# Altium schematic sheet Connectors.SchDoc: Connectors
size Letter; DrawnBy: Adrianna Ascalon; Organization: UW Robotics; Address1: 200 University Avenue; Address2: Waterloo; Address3: Ontario; Address4: Canada N2L 3G6; SheetNumber: 2; SheetTotal: 3
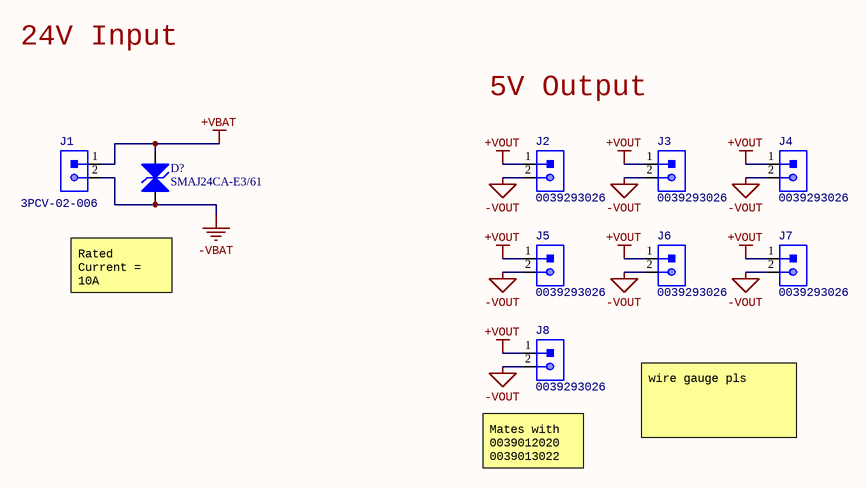
[diagram p0: Connectors.SchDoc]

## Parts
D?  SMAJ24CA-E3/61
J1  3PCV-02-006
J2  0039293026
J3  0039293026
J4  0039293026
J5  0039293026
J6  0039293026
J7  0039293026
J8  0039293026

## Nets
+VBAT: D?.2 J1.1
+VOUT: J2.1 J3.1 J4.1 J5.1 J6.1 J7.1 J8.1
-VBAT: D?.1 J1.2
-VOUT: J2.2 J3.2 J4.2 J5.2 J6.2 J7.2 J8.2

## Notes on the sheet
- 24V Input
- 5V Output
- Rated Current = 10A
- (near J8) Mates with 0039012020 0039013022
- wire gauge pls
- Title
- Size:
- Date:
- Letter
- Drawn By:
- Sheet
- of
- File:

## Library data of the parts
D? = SMAJ24CA-E3/61: TVS DIODE, 400W, 24V, DO-214AC; Manufacturer 1: Vishay Semiconductors; Polarity: Bidirectional; Min Breakdown Voltage: 26.7V; Clamping Voltage: 38.9V; Peak Pulse Current: 10.3A; Test Current: 1mA; Number of Elements: 1; Leakage Current: 1uA; Element Configuration: Single; Max Forward Surge Current (Ifsm): 40A; Power Line Protection: No; Max Breakdown Voltage: 29.5V; Supplier 1: Digi-Key; Stock 1: 6243; Pricing 1: 1=0.35000, 10=0.28400, 25=0.26000, 100=0.16340, 250=0.16152, 500=0.15126 (USD); RoHS: Yes; Case/Package: SMA; Number of Pins: 2; Weight: 0.064g; Contact Plating: Tin,Matte; Min Operating Temperature: -55°C; Max Operating Temperature: 150°C; Packaging: Tape and Reel; Reverse Standoff Voltage: 24V; Peak Pulse Power: 400W; Breakdown Voltage: 26.7V; Package Quantity: 1800; Max Surge Current: 10.3A; Direction: Bidirectional; Reverse Breakdown Voltage: 26.7V; Operating Supply Voltage: 24V; Max Reverse Leakage Current: 1uA; Number of Channels: 1; Max Power Dissipation: 400W; Number of Bidirectional Channels: 1; Composition: Zener; Termination: SMD/SMT; Power Dissipation: 400W; Voltage Rating (DC): 24V; Length: 0.177inch; Height: 0.09inch; Width: 0.11inch; Radiation Hardening: No; Lead Free: Lead Free; REACH SVHC: Unknown; ComponentLink1URL: https://datasheet.ciiva.com/15143/getdatasheetpartid-35124-15143026.pdf?src-supplier=Verical; ComponentLink1Description: https://datasheet.ciiva.com/15143/getdatasheetpartid-35124-15143026.pdf?src-supplier=Verical; ComponentLink2URL: https://datasheet.ciiva.com/4247/2smaj50a-4247844.pdf?src-supplier=Arrow; ComponentLink2Description: https://datasheet.ciiva.com/4247/2smaj50a-4247844.pdf?src-supplier=Arrow; ComponentLink3URL: https://datasheet.ciiva.com/4509/smaj50a-241759-4509561.pdf?src-supplier=Mouser; ComponentLink3Description: https://datasheet.ciiva.com/4509/smaj50a-241759-4509561.pdf?src-supplier=Mouser; ComponentLink4URL: https://datasheet.ciiva.com/22637/548547-22637055.pdf?src-supplier=Element14; ComponentLink4Description: https://datasheet.ciiva.com/22637/548547-22637055.pdf?src-supplier=Element14; Supplier Part Number 1: SMAJ24CA-E3/61GICT-ND; Manufacturer Part Number 1: SMAJ24CA-E3/61
J1 = 3PCV-02-006: Barrier Terminal Blocks TRI-BARRIER .250 2P; Manufacturer 1: TE Connectivity; Number of Contacts: 2; Voltage Rating: 300V; Current Rating: 10A; Mounting Ears: No (Without); Number of Levels: 1; Pitch: 6.35mm; Wire Gauge (Max): 16AWG; Wire Gauge (Min): 30AWG; Thread Size: M3; Supplier 1: Digi-Key; Stock 1: 3086; Pricing 1: 1=1.78000, 10=1.25100, 25=1.16720, 50=1.05920, 100=1.05460, 250=0.89052, 500=0.84364, 1000=0.74990, 5000=0.60930 (USD); RoHS: Yes; Mount: Through Hole; Housing Color: Black; Color: Black; Contact Plating: Tin; Contact Material: Copper Alloy; Terminal Material: Copper Alloy; Housing Material: Thermoplastic; Termination: Solder; Orientation: Straight; Package Quantity: 1000; Number of Rows: 1; Number of Circuits: 2; Number of Positions: 2; Mounting Insert: No (Without); Max Current Rating: 10A; Voltage: 300V; Length: 0.55inch; Height: 0.5inch; Width: 0.55inch; Radiation Hardening: No; Flammability Rating: UL94 V-0; ELV: Compliant; ComponentLink1URL: https://datasheet.ciiva.com/30058/eng-cs-1308389-barrier-strips-0607-30058410.pdf?src-supplier=Onlinecomponents.com; ComponentLink1Description: https://datasheet.ciiva.com/30058/eng-cs-1308389-barrier-strips-0607-30058410.pdf?src-supplier=Onlinecomponents.com; ComponentLink2URL: https://datasheet.ciiva.com/9377/eng-ds-1-1773458-2-barrier-strips-qrg-0810-9377275.pdf?src-supplier=Avnet; ComponentLink2Description: https://datasheet.ciiva.com/9377/eng-ds-1-1773458-2-barrier-strips-qrg-0810-9377275.pdf?src-supplier=Avnet; Manufacturer Part Number 1: 3PCV-02-006
J2-J8 = 0039293026: Conn Wire to Board HDR 2 POS Solder ST Thru-Hole Mini-Fit Jr™ Bag; Manufacturer 1: Molex; Number of Contacts: 2; Gender: Male; Contact Resistance: 10mR; Connector Type: Male Pin; Pitch: 4.2mm; Row Spacing: 0.165inch; Supplier 1: Digi-Key; Stock 1: 23064; Pricing 1: 1=0.54000, 10=0.50400, 100=0.38660, 500=0.33620, 1000=0.27737, 5000=0.24375, 10000=0.22694 (USD); RoHS: Yes; Mount: Through Hole; Contact Material: Brass; Contact Plating: Tin,Copper,Bright; Housing Material: Nylon; Color: Natural; Min Operating Temperature: -40°C; Max Operating Temperature: 105°C; Packaging: Bulk; Number of Rows: 2; Orientation: Straight; Number of Positions: 2; Termination: Solder; Fastening Type: Ramp; Length: 5.8mm; Depth: 11mm; ComponentLink1URL: https://datasheet.ciiva.com/3117/0039293026-pcb-headers-3117298.pdf?src-supplier=Avnet; ComponentLink1Description: https://datasheet.ciiva.com/3117/0039293026-pcb-headers-3117298.pdf?src-supplier=Avnet; ComponentLink2URL: https://datasheet.ciiva.com/26921/getdatasheetpartid-310796-26921947.pdf?src-supplier=Verical; ComponentLink2Description: https://datasheet.ciiva.com/26921/getdatasheetpartid-310796-26921947.pdf?src-supplier=Verical; ComponentLink3URL: https://datasheet.ciiva.com/18486/039293026-sd-18486507.pdf?src-supplier=Digi-Key; ComponentLink3Description: https://datasheet.ciiva.com/18486/039293026-sd-18486507.pdf?src-supplier=Digi-Key; Supplier Part Number 1: WM3843-ND; Manufacturer Part Number 1: 0039293026